# Altium schematic sheet Main.SchDoc
size A4; SheetNumber: 1; SheetTotal: 6
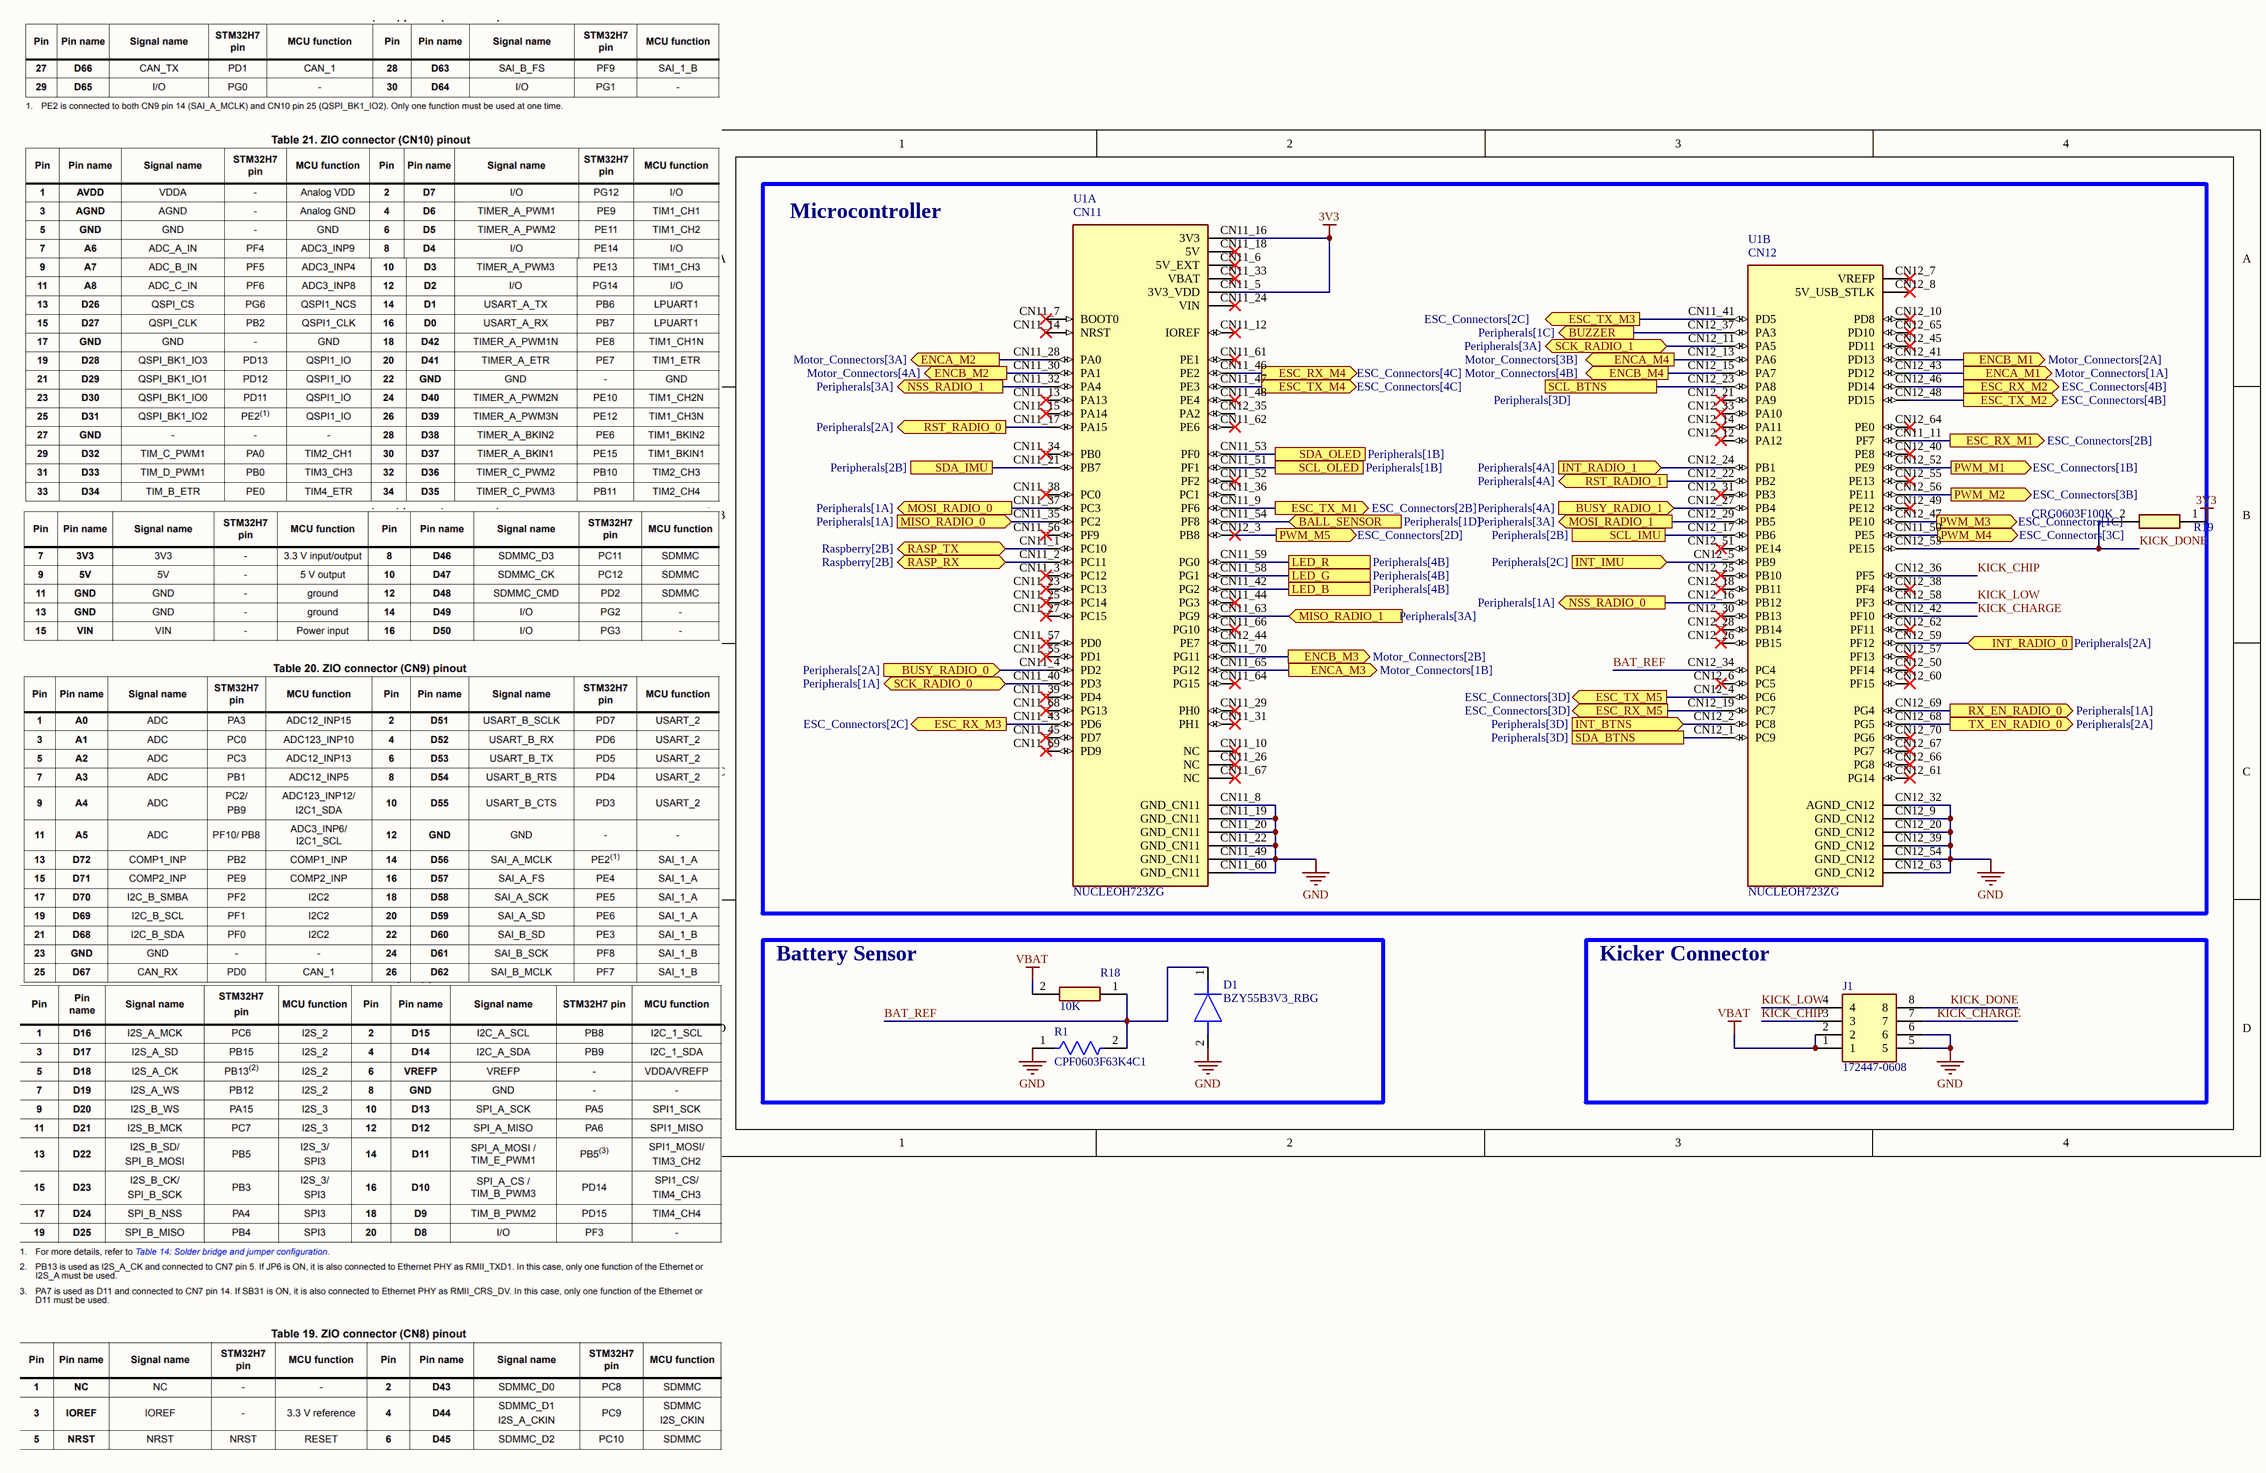
[diagram p0: Main.SchDoc]

## Parts
D1  BZY55B3V3_RBG  [BZY55B3V3RBG]
J1  172447-0608  [172447-YY08]
R1  CPF0603F63K4C1  [FP-CPF0603-MFG]
R18  10K  [RESC1608X55N]
R19  CRG0603F100K  [RESC1608X55N]
U1  NUCLEOH723ZG  [NEW_NUCLEO]  (parts A,B of 2)

## Blocks framed on the sheet
Microcontroller: R19 U1
Battery Sensor: D1 R1 R18
Kicker Connector: J1

## Ports
BALL_SENSOR (in, see Peripherals[1D]), BUSY_RADIO_0 (in, see Peripherals[2A]), BUSY_RADIO_1 (in, see Peripherals[4A]), BUZZER (out, see Peripherals[1C]), ENCA_M1 (out, see Motor_Connectors[1A]), ENCA_M2 (out, see Motor_Connectors[3A]), ENCA_M3 (out, see Motor_Connectors[1B]), ENCA_M4 (out, see Motor_Connectors[3B]), ENCB_M1 (out, see Motor_Connectors[2A]), ENCB_M2 (out, see Motor_Connectors[4A]), ENCB_M3 (out, see Motor_Connectors[2B]), ENCB_M4 (out, see Motor_Connectors[4B]), ESC_RX_M1 (out, see ESC_Connectors[2B]), ESC_RX_M2 (out, see ESC_Connectors[4B]), ESC_RX_M3 (out, see ESC_Connectors[2C]), ESC_RX_M4 (out, see ESC_Connectors[4C]), ESC_RX_M5 (out, see ESC_Connectors[3D]), ESC_TX_M1 (out, see ESC_Connectors[2B]), ESC_TX_M2 (out, see ESC_Connectors[4B]), ESC_TX_M3 (out, see ESC_Connectors[2C]), ESC_TX_M4 (out, see ESC_Connectors[4C]), ESC_TX_M5 (out, see ESC_Connectors[3D]), INT_BTNS (in, see Peripherals[3D]), INT_IMU (in, see Peripherals[2C]), INT_RADIO_0 (in, see Peripherals[2A]), INT_RADIO_1 (in, see Peripherals[4A]), LED_B (see Peripherals[4B]), LED_G (see Peripherals[4B]), LED_R (see Peripherals[4B]), MISO_RADIO_0 (in, see Peripherals[1A]), MISO_RADIO_1 (in, see Peripherals[3A]), MOSI_RADIO_0 (out, see Peripherals[1A]), MOSI_RADIO_1 (out, see Peripherals[3A]), NSS_RADIO_0 (out, see Peripherals[1A]), NSS_RADIO_1 (out, see Peripherals[3A]), PWM_M1 (out, see ESC_Connectors[1B]), PWM_M2 (out, see ESC_Connectors[3B]), PWM_M3 (out, see ESC_Connectors[1C]), PWM_M4 (out, see ESC_Connectors[3C]), PWM_M5 (out, see ESC_Connectors[2D]), RASP_RX (bidir, see Raspberry[2B]), RASP_TX (bidir, see Raspberry[2B]), RST_RADIO_0 (out, see Peripherals[2A]), RST_RADIO_1 (out, see Peripherals[4A]), RX_EN_RADIO_0 (out, see Peripherals[1A]), SCK_RADIO_0 (bidir, see Peripherals[1A]), SCK_RADIO_1 (bidir, see Peripherals[3A]), SCL_BTNS (see Peripherals[3D]), SCL_IMU (see Peripherals[2B]), SCL_OLED (see Peripherals[1B]), SDA_BTNS (see Peripherals[3D]), SDA_IMU (see Peripherals[2B]), SDA_OLED (see Peripherals[1B]), TX_EN_RADIO_0 (out, see Peripherals[2A])

## Nets
3V3: R19.1 U1.CN11_5(3V3_VDD) U1.CN11_16(3V3)
GND: D1.2(A) J1.5 J1.6 R1.1 U1.CN11_8(GND_CN11) U1.CN11_19(GND_CN11) U1.CN11_20(GND_CN11) U1.CN11_22(GND_CN11) U1.CN11_49(GND_CN11) U1.CN11_60(GND_CN11) U1.CN12_9(GND_CN12) U1.CN12_20(GND_CN12) U1.CN12_32(AGND_CN12) U1.CN12_39(GND_CN12) U1.CN12_54(GND_CN12) U1.CN12_63(GND_CN12)
VBAT: J1.1 J1.2 R18.2
BALL_SENSOR: U1.CN11_54(PF8) ; port BALL_SENSOR
BAT_REF: D1.1(K) R1.2 R18.1 U1.CN12_34(PC4)
BUSY_RADIO_0: U1.CN11_4(PD2) ; port BUSY_RADIO_0
BUSY_RADIO_1: U1.CN12_27(PB4) ; port BUSY_RADIO_1
BUZZER: U1.CN12_37(PA3) ; port BUZZER
ENCA_M1: U1.CN12_43(PD12) ; port ENCA_M1
ENCA_M2: U1.CN11_28(PA0) ; port ENCA_M2
ENCA_M3: U1.CN11_65(PG12) ; port ENCA_M3
ENCA_M4: U1.CN12_13(PA6) ; port ENCA_M4
ENCB_M1: U1.CN12_41(PD13) ; port ENCB_M1
ENCB_M2: U1.CN11_30(PA1) ; port ENCB_M2
ENCB_M3: U1.CN11_70(PG11) ; port ENCB_M3
ENCB_M4: U1.CN12_15(PA7) ; port ENCB_M4
ESC_RX_M1: U1.CN11_11(PF7) ; port ESC_RX_M1
ESC_RX_M2: U1.CN12_46(PD14) ; port ESC_RX_M2
ESC_RX_M3: U1.CN11_43(PD6) ; port ESC_RX_M3
ESC_RX_M4: U1.CN11_46(PE2) ; port ESC_RX_M4
ESC_RX_M5: U1.CN12_19(PC7) ; port ESC_RX_M5
ESC_TX_M1: U1.CN11_9(PF6) ; port ESC_TX_M1
ESC_TX_M2: U1.CN12_48(PD15) ; port ESC_TX_M2
ESC_TX_M3: U1.CN11_41(PD5) ; port ESC_TX_M3
ESC_TX_M4: U1.CN11_47(PE3) ; port ESC_TX_M4
ESC_TX_M5: U1.CN12_4(PC6) ; port ESC_TX_M5
INT_BTNS: U1.CN12_2(PC8) ; port INT_BTNS
INT_IMU: U1.CN12_5(PB9) ; port INT_IMU
INT_RADIO_0: U1.CN12_59(PF12) ; port INT_RADIO_0
INT_RADIO_1: U1.CN12_24(PB1) ; port INT_RADIO_1
KICK_CHARGE: J1.7 U1.CN12_42(PF10)
KICK_CHIP: J1.3 U1.CN12_36(PF5)
KICK_DONE: J1.8 R19.2 U1.CN12_53(PE15)
KICK_LOW: J1.4 U1.CN12_58(PF3)
LED_B: U1.CN11_42(PG2) ; port LED_B
LED_G: U1.CN11_58(PG1) ; port LED_G
LED_R: U1.CN11_59(PG0) ; port LED_R
MISO_RADIO_0: U1.CN11_35(PC2) ; port MISO_RADIO_0
MISO_RADIO_1: U1.CN11_63(PG9) ; port MISO_RADIO_1
MOSI_RADIO_0: U1.CN11_37(PC3) ; port MOSI_RADIO_0
MOSI_RADIO_1: U1.CN12_29(PB5) ; port MOSI_RADIO_1
NSS_RADIO_0: U1.CN12_16(PB12) ; port NSS_RADIO_0
NSS_RADIO_1: U1.CN11_32(PA4) ; port NSS_RADIO_1
PWM_M1: U1.CN12_52(PE9) ; port PWM_M1
PWM_M2: U1.CN12_56(PE11) ; port PWM_M2
PWM_M3: U1.CN12_47(PE10) ; port PWM_M3
PWM_M4: U1.CN11_50(PE5) ; port PWM_M4
PWM_M5: U1.CN12_3(PB8) ; port PWM_M5
RASP_RX: U1.CN11_2(PC11) ; port RASP_RX
RASP_TX: U1.CN11_1(PC10) ; port RASP_TX
RST_RADIO_0: U1.CN11_17(PA15) ; port RST_RADIO_0
RST_RADIO_1: U1.CN12_22(PB2) ; port RST_RADIO_1
RX_EN_RADIO_0: U1.CN12_69(PG4) ; port RX_EN_RADIO_0
SCK_RADIO_0: U1.CN11_40(PD3) ; port SCK_RADIO_0
SCK_RADIO_1: U1.CN12_11(PA5) ; port SCK_RADIO_1
SCL_BTNS: U1.CN12_23(PA8) ; port SCL_BTNS
SCL_IMU: U1.CN12_17(PB6) ; port SCL_IMU
SCL_OLED: U1.CN11_51(PF1) ; port SCL_OLED
SDA_BTNS: U1.CN12_1(PC9) ; port SDA_BTNS
SDA_IMU: U1.CN11_21(PB7) ; port SDA_IMU
SDA_OLED: U1.CN11_53(PF0) ; port SDA_OLED
TX_EN_RADIO_0: U1.CN12_68(PG5) ; port TX_EN_RADIO_0

Not connected (* = marked no-connect by the designer): U1 CN11_3(PC12)* CN11_6(5V_EXT)* CN11_7(BOOT0)* CN11_10(NC)* CN11_12(IOREF)* CN11_13(PA13)* CN11_14(NRST)* CN11_15(PA14)* CN11_18(5V)* CN11_23(PC13)* CN11_24(VIN)* CN11_25(PC14)* CN11_26(NC)* CN11_27(PC15)* CN11_29(PH0)* CN11_31(PH1)* CN11_33(VBAT)* CN11_34(PB0)* CN11_36(PC1) CN11_38(PC0)* CN11_39(PD4)* CN11_44(PG3)* CN11_45(PD7)* CN11_48(PE4)* CN11_52(PF2)* CN11_55(PD1)* CN11_56(PF9)* CN11_57(PD0)* CN11_61(PE1)* CN11_62(PE6)* CN11_64(PG15)* CN11_66(PG10)* CN11_67(NC)* CN11_68(PG13)* CN11_69(PD9)* CN12_6(PC5)* CN12_7(VREFP)* CN12_8(5V_USB_STLK)* CN12_10(PD8)* CN12_12(PA12)* CN12_14(PA11)* CN12_18(PB11)* CN12_21(PA9)* CN12_25(PB10)* CN12_26(PB15)* CN12_28(PB14)* CN12_30(PB13)* CN12_31(PB3)* CN12_33(PA10)* CN12_35(PA2) CN12_38(PF4)* CN12_40(PE8)* CN12_44(PE7) CN12_45(PD11)* CN12_49(PE12)* CN12_50(PF14)* CN12_51(PE14)* CN12_55(PE13)* CN12_57(PF13)* CN12_60(PF15)* CN12_61(PG14)* CN12_62(PF11)* CN12_64(PE0)* CN12_65(PD10)* CN12_66(PG8)* CN12_67(PG7)* CN12_70(PG6)*

## Notes on the sheet
- (in symbol NUCLEOH723ZG, part A) CN11
- (in symbol NUCLEOH723ZG, part B) CN12

## Library data of the parts
D1 = BZY55B3V3_RBG: Diode; Manufacturer_Name: Taiwan Semiconductor; Manufacturer_Part_Number: BZY55B3V3 RBG; Datasheet Link: https://componentsearchengine.com/Datasheets/1/BZY55B3V3 RBG.pdf; Height: 0.85mm; Mouser Part Number: 821-BZY55B3V3RBG; Mouser Price/Stock: https://www.mouser.co.uk/ProductDetail/Taiwan-Semiconductor/BZY55B3V3-RBG?qs=mAH9sUMRCtvrJdI%2FtfeTug%3D%3D
J1 = 172447-0608: Connector; Manufacturer_Name: Molex; Datasheet Link: https://www.molex.com/pdm_docs/sd/1724470406_sd.pdf; Height: 12.8mm; Manufacturer_Part_Number: 172447-0608; Mouser Part Number: 538-172447-0608; Mouser Price/Stock: https://www.mouser.co.uk/ProductDetail/Molex/172447-0608?qs=t7xnP681wgUaroQMnMhOkA%3D%3D
R1 = CMP-03211-001472-1: RES SMD 63.4KΩ 1% 1/16W 0603; Manufacturer: TE Connectivity; Voltage Rating: 50V; Temperature Coefficient: 50ppm/°C; Power Rating: 0.063W; Composition: Thin Film; Octopart: https://octopart.com/cpf0603f63k4c1-te+connectivity-7515022; Temperature Range High: +155°C; Lead Free: Yes; Series: CPF; Resistance: 63.4KΩ; Height: 0.55mm; Package: CPF0603; Manufacturer Part Number: CPF0603F63K4C1; Temperature: -55°C to +155°C; Device Class L3: Chip SMD Resistors; Ipc Land Pattern Name: RESC15580X45; RoHS: TRUE; Category: Res; ComponentLink2URL: https://www.te.com/commerce/DocumentDelivery/DDEController?Action=showdoc&DocId=Data+Sheet%7F1773200%7FM%7Fpdf%7FEnglish%7FENG_DS_1773200_M.pdf%7F3-1676481-2; Value: 63.4KΩ; packaging: 1k Reel; Tolerance: 1%; Automotive: No; Device Class L2: Resistors; Device Class L1: Passive Components; Temperature Range Low: -55°C; ComponentLink2Description: Datasheet; octopart_url: https://octopart.com/cpf0603f63k4c1-te+connectivity-7515022
R18 = ERJ-U3RD1002V: Resistor; Manufacturer_Name: Panasonic; Datasheet Link: https://industrial.panasonic.com/cdbs/www-data/pdf/RDP0000/RDP0000C343.pdf; Height: 0.55mm; Manufacturer_Part_Number: ERJ-U3RD1002V; Mouser Part Number: 667-ERJ-U3RD1002V; Mouser Price/Stock: https://www.mouser.co.uk/ProductDetail/Panasonic/ERJ-U3RD1002V?qs=TiOZkKH1s2Rg0qUjKdWcPw%3D%3D; Arrow Part Number: ERJ-U3RD1002V; Arrow Price/Stock: https://www.arrow.com/en/products/erj-u3rd1002v/panasonic?region=nac
R19 = CRG0603F100K: Resistor; Manufacturer_Name: TE Connectivity; Datasheet Link: http://docs-europe.electrocomponents.com/webdocs/13d1/0900766b813d116f.pdf; Height: 0.55mm; Manufacturer_Part_Number: CRG0603F100K; Mouser Part Number: 279-CRG0603F100K; Mouser Price/Stock: https://www.mouser.co.uk/ProductDetail/TE-Connectivity-Holsworthy/CRG0603F100K?qs=VHcS2MTj4gaG9fI5w0o7FA%3D%3D; Arrow Part Number: CRG0603F100K; Arrow Price/Stock: https://www.arrow.com/en/products/crg0603f100k/te-connectivity?region=nac
U1 = NUCLEOH723ZG: STM32H723ZG Nucleo-144 STM32H7 STM32 MCU 32-Bit Embedded Evaluation Board; MF: STMicroelectronics; Value: *; Purchase-URL: https://pricing.snapeda.com/search/part/NUCLEOH723ZG/?ref=eda; Package: None; Check_prices: https://www.snapeda.com/parts/NUCLEOH723ZG/STMicroelectronics/view-part/?ref=eda; MP: NUCLEOH723ZG; Price: None; SnapEDA_Link: https://www.snapeda.com/parts/NUCLEOH723ZG/STMicroelectronics/view-part/?ref=snap; Availability: In Stock